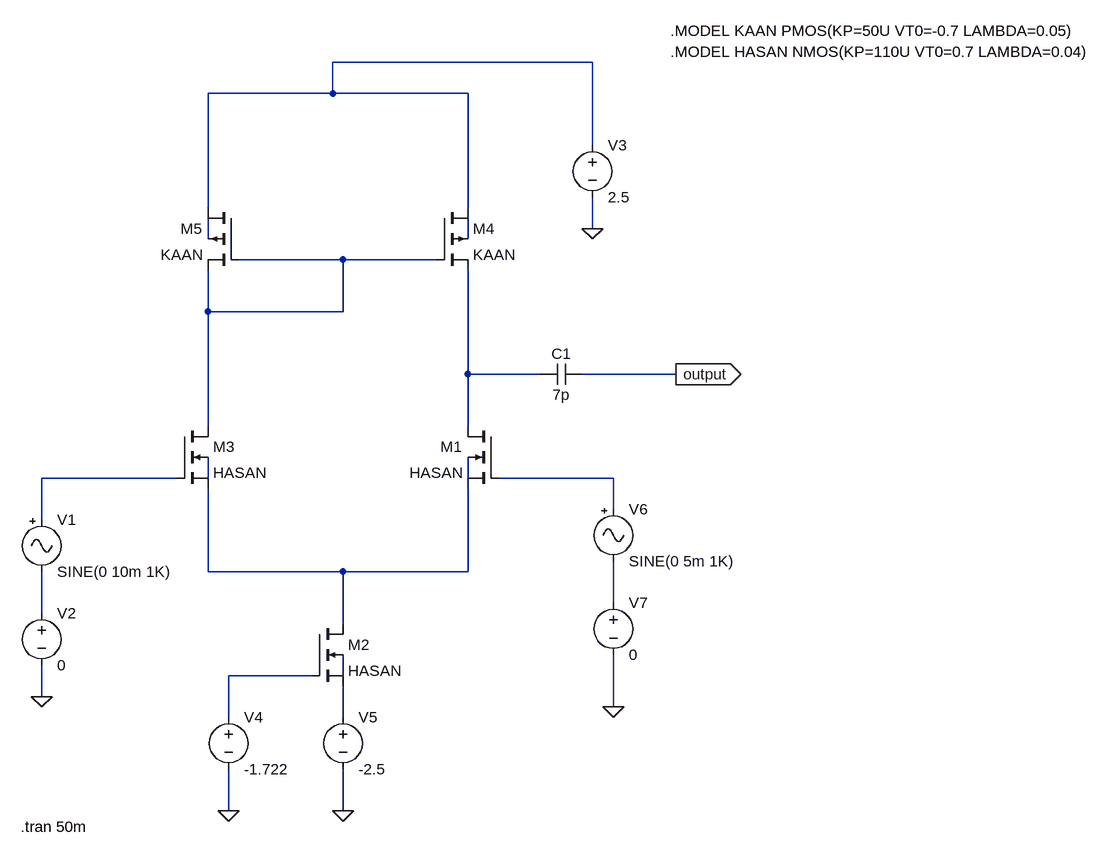
[diagram p0: schematic diferansiyel_kuvvetlendirici.asc]
diferansiyel_kuvvetlendirici.asc, the LTspice schematic file:
Version 4
SHEET 1 1632 744
WIRE 816 -448 416 -448
WIRE 416 -400 416 -448
WIRE 416 -400 224 -400
WIRE 624 -400 416 -400
WIRE 816 -320 816 -448
WIRE 224 -224 224 -400
WIRE 624 -224 624 -400
WIRE 816 -192 816 -240
WIRE 224 -176 224 -208
WIRE 624 -176 624 -208
WIRE 432 -144 272 -144
WIRE 576 -144 432 -144
WIRE 224 -64 224 -128
WIRE 432 -64 432 -144
WIRE 432 -64 224 -64
WIRE 624 32 624 -128
WIRE 736 32 624 32
WIRE 944 32 800 32
WIRE 224 112 224 -64
WIRE 624 112 624 32
WIRE 176 192 -32 192
WIRE 224 192 224 160
WIRE 624 192 624 160
WIRE 848 192 672 192
WIRE 848 240 848 192
WIRE -32 256 -32 192
WIRE 224 336 224 208
WIRE 432 336 224 336
WIRE 624 336 624 208
WIRE 624 336 432 336
WIRE 848 384 848 320
WIRE -32 400 -32 336
WIRE 432 416 432 336
WIRE 384 496 256 496
WIRE 432 496 432 464
WIRE -32 528 -32 480
WIRE 848 544 848 464
WIRE 256 560 256 496
WIRE 432 560 432 512
WIRE 256 704 256 640
WIRE 432 704 432 640
FLAG -32 528 0
FLAG 816 -192 0
FLAG 256 704 0
FLAG 432 704 0
FLAG 848 544 0
FLAG 944 32 output
IOPIN 944 32 Out
SYMBOL nmos4 672 112 M0
SYMATTR InstName M1
SYMATTR Value HASAN
SYMATTR Value2 l=10u w=276u
SYMBOL nmos4 384 416 R0
SYMATTR InstName M2
SYMATTR Value HASAN
SYMATTR Value2 l=10u w=4482u
SYMBOL nmos4 176 112 R0
SYMATTR InstName M3
SYMATTR Value HASAN
SYMATTR Value2 l=10u w=276u
SYMBOL pmos4 576 -224 R0
SYMATTR InstName M4
SYMATTR Value KAAN
SYMATTR Value2 l=10u w=120u
SYMBOL pmos4 272 -224 M0
SYMATTR InstName M5
SYMATTR Value KAAN
SYMATTR Value2 l=10u w=120u
SYMBOL Misc\\signal -32 240 R0
WINDOW 123 0 0 Left 0
WINDOW 39 0 0 Left 0
SYMATTR InstName V1
SYMATTR Value SINE(0 10m 1K)
SYMBOL voltage -32 384 R0
WINDOW 123 0 0 Left 0
WINDOW 39 0 0 Left 0
SYMATTR InstName V2
SYMATTR Value 0
SYMBOL voltage 816 -336 R0
WINDOW 123 0 0 Left 0
WINDOW 39 0 0 Left 0
SYMATTR InstName V3
SYMATTR Value 2.5
SYMBOL voltage 256 544 R0
WINDOW 123 0 0 Left 0
WINDOW 39 0 0 Left 0
SYMATTR InstName V4
SYMATTR Value -1.722
SYMBOL voltage 432 544 R0
WINDOW 123 0 0 Left 0
WINDOW 39 0 0 Left 0
SYMATTR InstName V5
SYMATTR Value -2.5
SYMBOL Misc\\signal 848 224 R0
WINDOW 123 0 0 Left 0
WINDOW 39 0 0 Left 0
SYMATTR InstName V6
SYMATTR Value SINE(0 5m 1K)
SYMBOL voltage 848 368 R0
WINDOW 123 0 0 Left 0
WINDOW 39 0 0 Left 0
SYMATTR InstName V7
SYMATTR Value 0
SYMBOL cap 800 16 R90
WINDOW 0 0 32 VBottom 2
WINDOW 3 32 32 VTop 2
SYMATTR InstName C1
SYMATTR Value 7p
TEXT -64 728 Left 2 !.tran 50m
TEXT 936 -496 Left 2 !.MODEL KAAN PMOS(KP=50U VT0=-0.7 LAMBDA=0.05)
TEXT 936 -464 Left 2 !.MODEL HASAN NMOS(KP=110U VT0=0.7 LAMBDA=0.04)

The netlist it stands for:
* diferansiyel_kuvvetlendirici.asc
M1 N005 N009 N010 N008 HASAN l=10u w=276u
M2 N010 N013 N015 N014 HASAN l=10u w=4482u
M3 N004 N006 N010 N007 HASAN l=10u w=276u
M4 N001 N004 N005 N003 KAAN l=10u w=120u
M5 N001 N004 N004 N002 KAAN l=10u w=120u
V1 N006 N012 SINE(0 10m 1K)
V2 N012 0 0
V3 N001 0 2.5
V4 N013 0 -1.722
V5 N015 0 -2.5
V6 N009 N011 SINE(0 5m 1K)
V7 N011 0 0
C1 output N005 7p
.model NMOS NMOS
.model PMOS PMOS
.lib standard.mos
.tran 50m
.MODEL KAAN PMOS(KP=50U VT0=-0.7 LAMBDA=0.05)
.MODEL HASAN NMOS(KP=110U VT0=0.7 LAMBDA=0.04)
.backanno
.end